# EAGLE design TES1 (EAGLE 9.6.2)
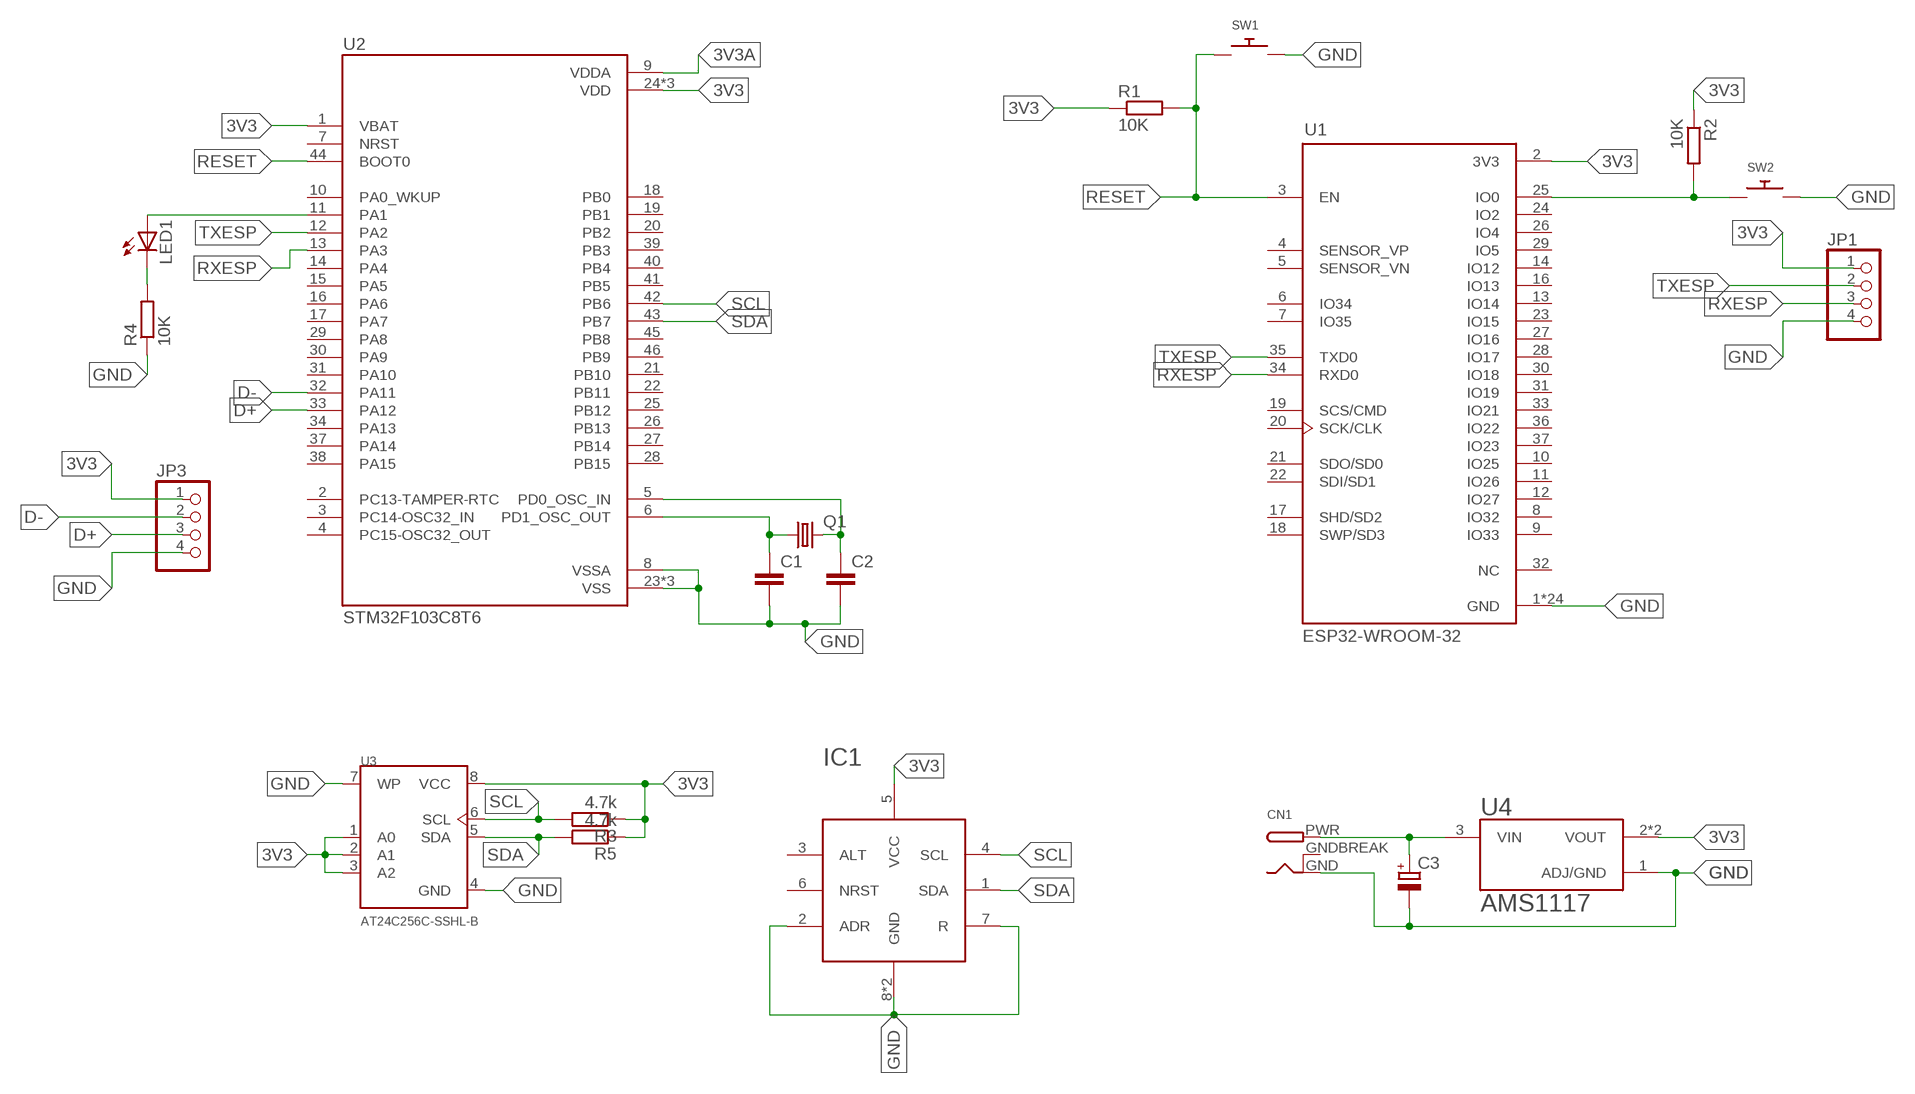
[diagram p0: schematic, sheet 1]

## Parts
C1  C-EUC0805  [C0805]
C2  C-EUC0805  [C0805]
C3  CPOL-EU150CLZ-0810  [150CLZ-0810]
CN1  DCBARRELPTH  [DCJACK_2MM_PTH]
IC1  SHT31  [SON50P250X250X90-9T110X180N]
JP1  PINHD-1X4  [1X04]
JP3  PINHD-1X4  [1X04]
LED1  LEDCHIP-LED0805  [CHIP-LED0805]
Q1  CRYSTALHC49U-V  [HC49U-V]
R1  10K  R-EU_R0805  [R0805]
R2  10K  R-EU_R0805  [R0805]
R3  4.7k  R-EU_R0805  [R0805]
R4  10K  R-EU_R0805  [R0805]
R5  4.7k  R-EU_R0805  [R0805]
SW1  SWITCH_PUSHBUTTONC&K_KSS  [BTN_CK_KSS]
SW2  SWITCH_PUSHBUTTONC&K_KSS  [BTN_CK_KSS]
U1  ESP32-WROOM-32  [MODULE_ESP32-WROOM-32]
U2  STM32F103C8T6  [QFP50P900X900X160-48N]
U3  AT24C256C-SSHL-B  [SOIC127P600X175-8N]
U4  AMS1117  [SOT229P700X180-4N]

## Nets
3V3: IC1.5(VCC) JP1.1 JP3.1 R1.1 R2.1 R3.1 R5.1 U1.2(3V3) U2.1(VBAT) U2.24(VDD) U2.36(VDD) U2.48(VDD) U3.1(A0) U3.2(A1) U3.3(A2) U3.8(VCC) U4.2(VOUT) U4.4(VOUT)
3V3A: U2.9(VDDA)
12V: C3.+ CN1.PWR U4.3(VIN)
D+: JP3.3 U2.33(PA12)
D-: JP3.2 U2.32(PA11)
GND: C1.2 C2.2 C3.- CN1.GND IC1.2(ADR) IC1.7(R) IC1.8(GND) IC1.9(GND) JP1.4 JP3.4 R4.1 SW1.P$2 SW2.P$2 U1.1(GND) U1.15(GND) U1.38(GND) U1.39_1(GND) U1.39_2(GND) U1.39_3(GND) U1.39_4(GND) U1.39_5(GND) U1.39_6(GND) U1.39_7(GND) U1.39_8(GND) U1.39_9(GND) U1.39_10(GND) U1.39_11(GND) U1.39_12(GND) U1.39_13(GND) U1.39_14(GND) U1.39_15(GND) U1.39_16(GND) U1.39_17(GND) U1.39_18(GND) U1.39_19(GND) U1.39_20(GND) U1.39_21(GND) U2.8(VSSA) U2.23(VSS) U2.35(VSS) U2.47(VSS) U3.4(GND) U3.7(WP) U4.1(ADJ/GND)
N$1: C1.1 Q1.1 U2.6(PD1_OSC_OUT)
N$2: C2.1 Q1.2 U2.5(PD0_OSC_IN)
N$4: R2.2 SW2.P$1 U1.25(IO0)
N$5: LED1.C R4.2
N$6: LED1.A U2.11(PA1)
RESET: R1.2 SW1.P$1 U1.3(EN) U2.44(BOOT0)
RXESP: JP1.3 U1.34(RXD0) U2.13(PA3)
SCL: IC1.4(SCL) R3.2 U2.42(PB6) U3.6(SCL)
SDA: IC1.1(SDA) R5.2 U2.43(PB7) U3.5(SDA)
TXESP: JP1.2 U1.35(TXD0) U2.12(PA2)
Unconnected: IC1.3(ALT) IC1.6(NRST) U1.4(SENSOR_VP) U1.5(SENSOR_VN) U1.6(IO34) U1.7(IO35) U1.8(IO32) U1.9(IO33) U1.10(IO25) U1.11(IO26) U1.12(IO27) U1.13(IO14) U1.14(IO12) U1.16(IO13) U1.17(SHD/SD2) U1.18(SWP/SD3) U1.19(SCS/CMD) U1.20(SCK/CLK) U1.21(SDO/SD0) U1.22(SDI/SD1) U1.23(IO15) U1.24(IO2) U1.26(IO4) U1.27(IO16) U1.28(IO17) U1.29(IO5) U1.30(IO18) U1.31(IO19) U1.32(NC) U1.33(IO21) U1.36(IO22) U1.37(IO23) U2.2(PC13-TAMPER-RTC) U2.3(PC14-OSC32_IN) U2.4(PC15-OSC32_OUT) U2.7(NRST) U2.10(PA0_WKUP) U2.14(PA4) U2.15(PA5) U2.16(PA6) U2.17(PA7) U2.18(PB0) U2.19(PB1) U2.20(PB2) U2.21(PB10) U2.22(PB11) U2.25(PB12) U2.26(PB13) U2.27(PB14) U2.28(PB15) U2.29(PA8) U2.30(PA9) U2.31(PA10) U2.34(PA13) U2.37(PA14) U2.38(PA15) U2.39(PB3) U2.40(PB4) U2.41(PB5) U2.45(PB8) U2.46(PB9)

## Power pins joined to a net without a drawn wire
GNDBREAK: CN1.GNDBREAK

## Library data of the parts
C1 C2 = rcl:C-EU: CAPACITOR, European symbol; SPICEPREFIX: C
C3 = rcl:CPOL-EU: POLARIZED CAPACITOR, European symbol; SPICEPREFIX: C
CN1 = adafruit:DCBARREL: 2.0mm DC Barrel Jack DCJACK_2MM_PTH - Through Hole Jack (4UConnector: 05537)
IC1 = SHT31:SHT31: A I2C temp/humidity sensor Check availability <https://pricing.snapeda.com/parts/SHT31/Sensirion%20AG/view-part?ref=eda>; AVAILABILITY: In Stock; CHECK_PRICES: https://www.snapeda.com/parts/SHT31/Sensirion+AG/view-part/?ref=eda; DESCRIPTION: Humidity Temperature Sensor 0 ~ 100% RH Analog Voltage ±2% RH 8s Surface Mount; MF: Sensirion AG; MP: SHT31; PACKAGE: VFDFN-8 Sensirion AG; PRICE: None; SNAPEDA_LINK: https://www.snapeda.com/parts/SHT31/Sensirion+AG/view-part/?ref=snap
JP1 JP3 = pinhead:PINHD-1X4: PIN HEADER
LED1 = adafruit:LED: LED OSRAM: - CHIPLED LG R971, LG N971, LY N971, LG Q971, LY Q971, LO R971, LY R971 LH N974, LH R974 LS Q976, LO Q976, LY Q976 LO Q996 - Hyper CHIPLED LW Q18S LB Q993, LB Q99A, LB R99A - SideLED LS A670, LO A670, LY A670, LG A670, LP A670 LB A673, LV A673, LT A673, LW A673 LH A674 LY A675 LS A676, LA A676, LO A676, LY A676, LW A676 LS A679, LY A679, LG A679 - Hyper Micro SIDELED® LS Y876, LA Y876, LO Y876, LY Y876 LT Y87S - SmartLED LW L88C, LW L88S LB L89C, LB L89S, LG L890 LS L89K, LO L89K, LY L89K LS L896, LA L896, LO L896, LY L896 - TOPLED LS T670, LO T670, LY T670, LG T670, LP T670 LSG T670, LSP T670, LSY T670, LOP T670, LYG T670 LG T671, LOG T671, LSG T671 LB T673, LV T673, LT T673, LW T673 LH T674 LS T676, LA T676, LO T676, LY T676, LB T676, LH T676, LSB T676, LW T676 LB T67C, LV T67C, LT T67C, LS T67K, LO T67K, LY T67K, LW E67C LS E67B, LA E67B, LO E67B, LY E67B, LB E67C, LV E67C, LT E67C LW T67C LS T679, LY T679, LG T679 LS T770, LO T770, LY T770, LG T770, LP T770 LB T773, LV T773, LT T773, LW T773 LH T774 LS E675, LA E675, LY E675, LS T675 LS T776, LA T776, LO T776, LY T776, LB T776 LHGB T686 LT T68C, LB T68C - Hyper Mini TOPLED® LB M676 - Mini TOPLED Santana® LG M470 LS M47K, LO M47K, LY M47K Source: http://www.osram.convergy.de/
Q1 = adafruit:CRYSTAL: CRYSTAL; OC_FARNELL: 1666969; OC_NEWARK: unknown
R1-R5 = rcl:R-EU_: RESISTOR, European symbol; SPICEPREFIX: R
SW1 SW2 = adafruit:SWITCH_PUSHBUTTON: Buttons SOFTTOUCHSMD_SJ - Soft touch temporary push button (Super Junk Akihabara) Compatible with SKPMANE010 [Mouser: 688-SKPMAN] C&K_KSS = Digikey: KSS221GLFS
U1 = ESP32-WROOM-32:ESP32-WROOM-32: Check availability <https://pricing.snapeda.com/parts/ESP32-WROOM-32/Espressif%20Systems/view-part?ref=eda>; AVAILABILITY: In Stock; CHECK_PRICES: https://www.snapeda.com/parts/ESP32-WROOM-32/Espressif+Systems/view-part/?ref=eda; DESCRIPTION: Bluetooth, WiFi 802.11b/g/n, Bluetooth v4.2 +EDR, Class 1, 2 and 3 Transceiver Module 2.4GHz ~ 2.5GHz Antenna Not Included, U.FL Surface Mount; MF: Espressif Systems; MP: ESP32-WROOM-32; PACKAGE: None; PRICE: None; SNAPEDA_LINK: https://www.snapeda.com/parts/ESP32-WROOM-32/Espressif+Systems/view-part/?ref=snap
U2 = STM32F103C8T6:STM32F103C8T6: Mainstream Performance line, ARM Cortex-M3 MCU with 64 Kbytes Flash, 72 MHz CPU, motor control, USB and CAN Check availability <https://pricing.snapeda.com/parts/STM32F103C8T6/STMicroelectronics/view-part?ref=eda>; AVAILABILITY: In Stock; CHECK_PRICES: https://www.snapeda.com/parts/STM32F103C8T6/STMicroelectronics/view-part/?ref=eda; DESCRIPTION: ARM® Cortex®-M3 STM32F1 Microcontroller IC 32-Bit 72MHz 64KB (64K x 8) FLASH 48-LQFP (7x7); MF: STMicroelectronics; MP: STM32F103C8T6; PACKAGE: LQFP-48 STMicroelectronics; PRICE: None; PURCHASE-URL: https://www.snapeda.com/api/url_track_click_mouser/?unipart_id=52195&manufacturer=STMicroelectronics&part_name=STM32F103C8T6&search_term=stm32f103c8t6; SNAPEDA_LINK: https://www.snapeda.com/parts/STM32F103C8T6/STMicroelectronics/view-part/?ref=snap
U3 = AT24C256C-SSHL-B:AT24C256C-SSHL-B: EEPROM Serial-2Wire 256K-bit 32K x 8 1.8V/2.5V/3.3V/5V 8-Pin SOIC Bulk Check availability <https://pricing.snapeda.com/parts/AT24C256C-SSHL-B/Microchip/view-part?ref=eda>; AVAILABILITY: In Stock; CHECK_PRICES: https://www.snapeda.com/parts/AT24C256C-SSHL-B/Microchip/view-part/?ref=eda; DESCRIPTION: EEPROM Memory IC 256Kb (32K x 8) I²C 1 MHz 550 ns 8-SOIC; MF: Microchip; MP: AT24C256C-SSHL-B; PACKAGE: SO-8 Microchip; PRICE: None; PURCHASE-URL: https://www.snapeda.com/api/url_track_click_mouser/?unipart_id=2112315&manufacturer=Microchip&part_name=AT24C256C-SSHL-B&search_term=at24c256; SNAPEDA_LINK: https://www.snapeda.com/parts/AT24C256C-SSHL-B/Microchip/view-part/?ref=snap
U4 = AMS1117:AMS1117: Sot223/Pkg 1-Amp 5-Volt Low Drop Out Voltage Regulatator Check availability <https://pricing.snapeda.com/parts/AMS1117/Advanced%20Monolithic%20Systems/view-part?ref=eda>; AVAILABILITY: Not in stock; CHECK_PRICES: https://www.snapeda.com/parts/AMS1117/Advanced+Monolithic+Systems/view-part/?ref=eda; DESCRIPTION: 1A LOW DROPOUT VOLTAGE REGULATOR SOT-223; MF: Advanced Monolithic Systems; MP: AMS1117; PACKAGE: SOT-223 Seeed Technology; PRICE: None; SNAPEDA_LINK: https://www.snapeda.com/parts/AMS1117/Advanced+Monolithic+Systems/view-part/?ref=snap

## Board
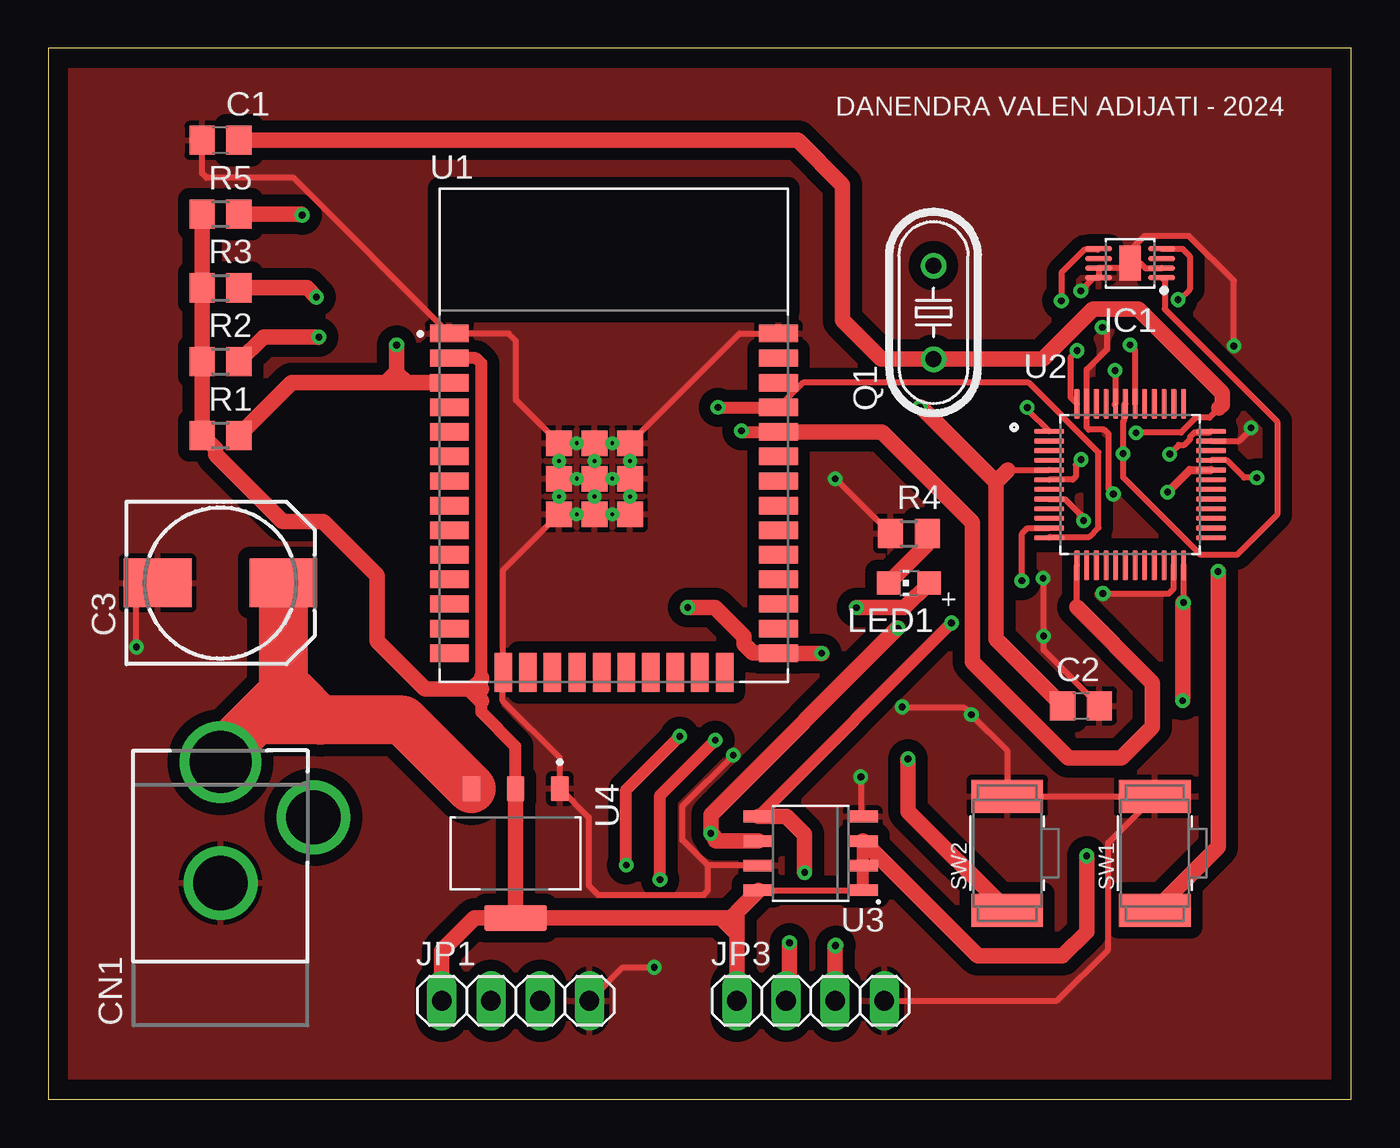
[diagram p1: board, top side]
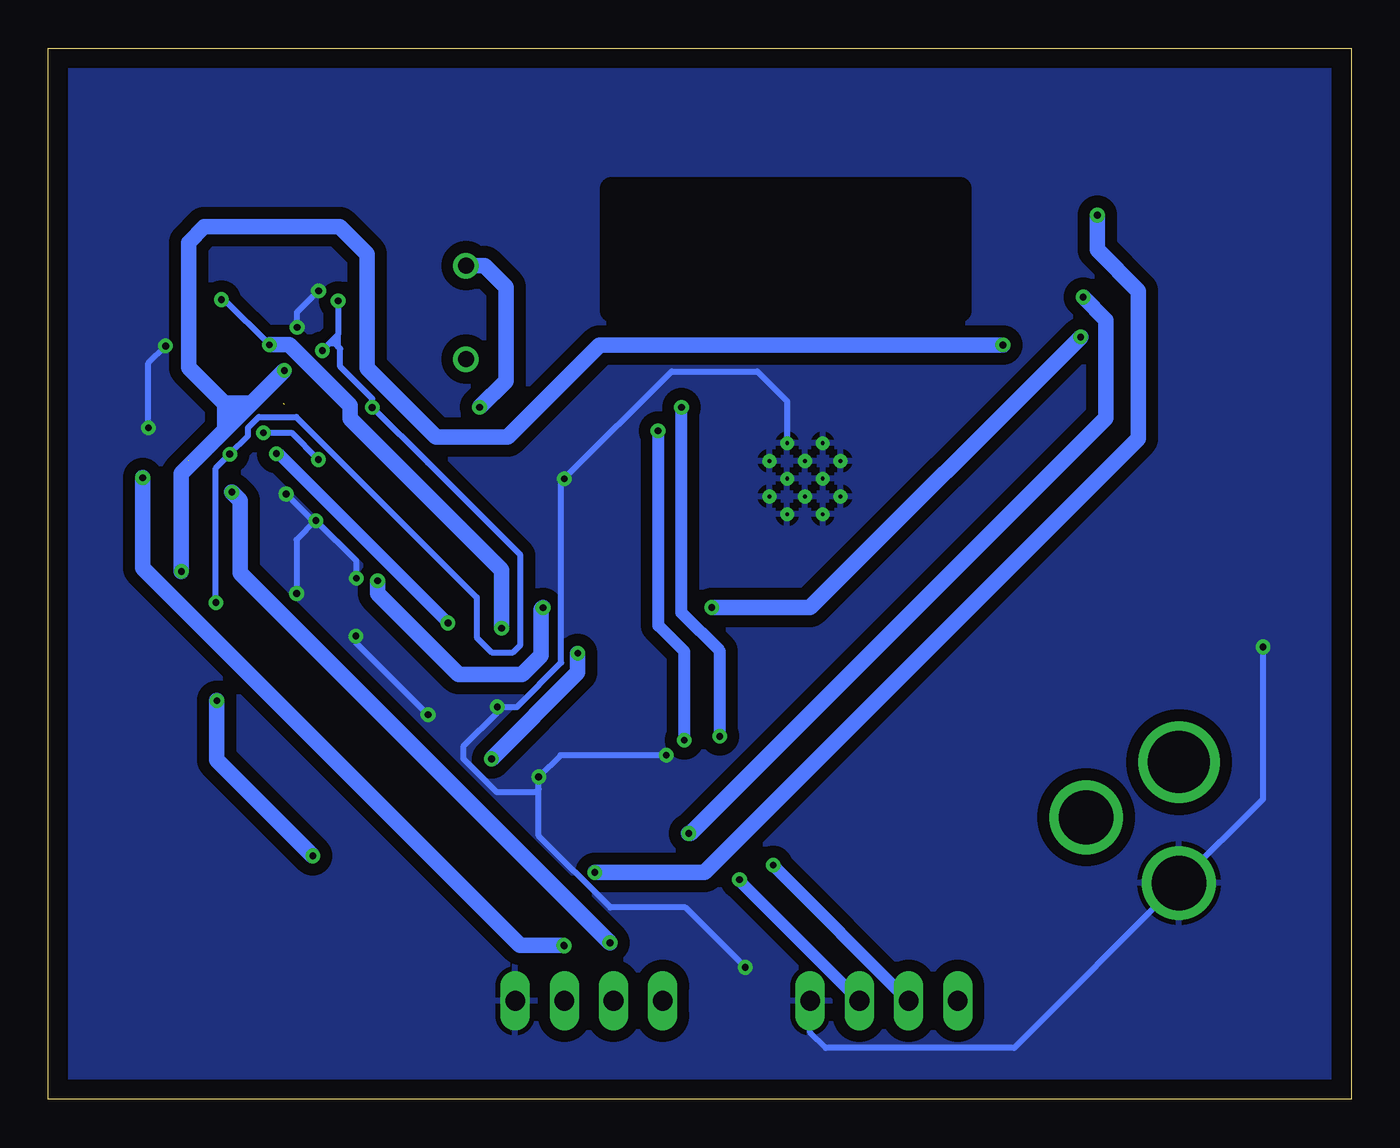
[diagram p2: board, bottom side, seen from below]

Size 67.29 x 54.28 mm. Coordinates in mm from the lower left corner, seen from the top.
Outline: 0,0 67.29,0 67.29,54.28 0,54.28 0,0
Copper layers (1*16): Top 0.035mm / dielectric 1.5mm / Bottom 0.035mm
Design rules "default": minimum track width 6mil, minimum drill 0.35mm, track to track 6mil, track to pad 6mil, pad to pad 6mil, via to via 6mil, smd to smd 6mil, copper to edge 40mil, drill to drill 6mil, minimum pad ring 10mil, minimum via ring 8mil, stop-mask expansion 4mil, vias tented up to drill 0mil, thermal gap 10mil

### Footprints (pad centres in the part's own frame; a part is rotated, then mirrored left to right if it is on the bottom)
C0805 = smd 1.3 x 1.5: 1 -0.95,0; 2 0.95,0
150CLZ-0810 = smd 3.5 x 2.5: + 3.25,0; - -3.25,0
DCJACK_2MM_PTH = drill 2.8: GND 0,7.35; GNDBREAK 4.8,10.75 | drill 3.2: PWR 0,13.6
SON50P250X250X90-9T110X180N = smd 1.4 x 0.282: 1 -1.625,0.75; 2 -1.625,0.25; 3 -1.625,-0.25; 4 -1.625,-0.75; 5 1.625,-0.75; 6 1.625,-0.25; 7 1.625,0.25; 8 1.625,0.75 | smd 1.1 x 1.8: 9 0,0
1X04 = drill 1.016 long: 1 -3.81,0; 2 -1.27,0; 3 1.27,0; 4 3.81,0
CHIP-LED0805 = smd 1.2 x 1.2: A 0,-1.05; C 0,1.05
HC49U-V = drill 0.813: 1 -2.413,0; 2 2.413,0
R0805 = smd 1.3 x 1.5: 1 -0.95,0; 2 0.95,0
BTN_CK_KSS = smd 1.7 x 3.7: P$1 -2.95,0; P$2 2.95,0
MODULE_ESP32-WROOM-32 = smd 2 x 0.9: 1 -8.5,5.26; 2 -8.5,3.99; 3 -8.5,2.72; 4 -8.5,1.45; 5 -8.5,0.18; 6 -8.5,-1.09; 7 -8.5,-2.36; 8 -8.5,-3.63; 9 -8.5,-4.9; 10 -8.5,-6.17; 11 -8.5,-7.44; 12 -8.5,-8.71; 13 -8.5,-9.98; 14 -8.5,-11.25; 25 8.5,-11.25; 26 8.5,-9.98; 27 8.5,-8.71; 28 8.5,-7.44; 29 8.5,-6.17; 30 8.5,-4.9; 31 8.5,-3.63; 32 8.5,-2.36; 33 8.5,-1.09; 34 8.5,0.18; 35 8.5,1.45; 36 8.5,2.72; 37 8.5,3.99; 38 8.5,5.26 | smd 0.9 x 2: 15 -5.715,-12.25; 16 -4.445,-12.25; 17 -3.175,-12.25; 18 -1.905,-12.25; 19 -0.635,-12.25; 20 0.635,-12.25; 21 1.905,-12.25; 22 3.175,-12.25; 23 4.445,-12.25; 24 5.715,-12.25 | smd 1.33 x 1.33: 39_1 -2.835,-0.405; 39_2 -1,-0.405; 39_3 0.835,-0.405; 39_4 -2.835,-2.24; 39_5 -1,-2.24; 39_6 0.835,-2.24; 39_7 -2.835,-4.075; 39_8 -1,-4.075; 39_9 0.835,-4.075 | drill 0.2 pad 0.3: 39_10 -1.917,-0.405; 39_11 -0.083,-0.405; 39_12 -2.835,-1.323; 39_13 -1,-1.323; 39_14 0.835,-1.323; 39_15 -1.917,-2.24; 39_16 -0.083,-2.24; 39_17 -2.835,-3.158; 39_18 -1,-3.158; 39_19 0.835,-3.158; 39_20 -1.917,-4.075; 39_21 -0.083,-4.075
QFP50P900X900X160-48N = smd 1.56 x 0.28: 1 -4.18,2.75; 2 -4.18,2.25; 3 -4.18,1.75; 4 -4.18,1.25; 5 -4.18,0.75; 6 -4.18,0.25; 7 -4.18,-0.25; 8 -4.18,-0.75; 9 -4.18,-1.25; 10 -4.18,-1.75; 11 -4.18,-2.25; 12 -4.18,-2.75; 25 4.18,-2.75; 26 4.18,-2.25; 27 4.18,-1.75; 28 4.18,-1.25; 29 4.18,-0.75; 30 4.18,-0.25; 31 4.18,0.25; 32 4.18,0.75; 33 4.18,1.25; 34 4.18,1.75; 35 4.18,2.25; 36 4.18,2.75 | smd 0.28 x 1.56: 13 -2.75,-4.18; 14 -2.25,-4.18; 15 -1.75,-4.18; 16 -1.25,-4.18; 17 -0.75,-4.18; 18 -0.25,-4.18; 19 0.25,-4.18; 20 0.75,-4.18; 21 1.25,-4.18; 22 1.75,-4.18; 23 2.25,-4.18; 24 2.75,-4.18; 37 2.75,4.18; 38 2.25,4.18; 39 1.75,4.18; 40 1.25,4.18; 41 0.75,4.18; 42 0.25,4.18; 43 -0.25,4.18; 44 -0.75,4.18; 45 -1.25,4.18; 46 -1.75,4.18; 47 -2.25,4.18; 48 -2.75,4.18
SOIC127P600X175-8N = smd 1.55 x 0.6: 1 -2.7,1.905; 2 -2.7,0.635; 3 -2.7,-0.635; 4 -2.7,-1.905; 5 2.7,-1.905; 6 2.7,-0.635; 7 2.7,0.635; 8 2.7,1.905
SOT229P700X180-4N = smd 1.31 x 0.93: 1 -3.345,2.29; 2 -3.345,0; 3 -3.345,-2.29 | smd 1.31 x 3.24: 4 3.345,0

### Placement (x,y rotation side)
C1  8.89,49.53 180 top
C2  53.34,20.32 0 top
C3  8.89,26.67 0 top
CN1  8.89,3.81 0 top
IC1  55.88,43.18 180 top
JP1  24.13,5.08 0 top
JP3  39.37,5.08 0 top
LED1  44.45,26.67 90 top
Q1  45.72,40.64 90 top
R1  8.89,34.29 0 top
R2  8.89,38.1 0 top
R3  8.89,41.91 0 top
R4  44.45,29.21 0 top
R5  8.89,45.72 0 top
SW1  57.15,12.7 90 top
SW2  49.53,12.7 90 top
U1  29.21,34.29 0 top
U2  55.88,31.75 0 top
U3  39.37,12.7 180 top
U4  24.13,12.7 270 top

### Tracks (layer width: path | path; a pad name or v marks a point on that pad's centre or on a via)
3V3  (via drill 0.35)
  Top 0.305: IC1.5 54.2,43.88 53.51,43.88 52.33,42.69 v52.33,41.23 | v53.14,38.67 52.79,38.32 52.79,36.27 U2.48 | U2.24 58.63,25.66 v58.64,25.65 | v57.92,33.32 58.39,33.79 58.67,33.79 58.98,34.1 58.98,34.23 59.2,34.45 60.01,34.45 U2.36 | U2.1 50.59,35.61 50.59,35.78 50.56,35.76 v50.56,35.73 | U3.8 U3.1
  Top 0.61: U4.2 24.13,18.23 22.36,19.99 22.36,20.58 22.36,21.18 22.36,21.77 22.36,38 22.09,38.28 U1.2 | U3.1 U3.2 U3.3
  Top 0.813: R5.1 R3.1 R2.1 R1.1 8.63,33.6 8.63,33.31 12.1,29.84 14.19,29.84 16.97,27.06 16.97,23.67 19.47,21.18 21.85,21.18 | U4.4 22.02,9.36 20.32,7.65 JP1.1 | JP3.1 35.56,8.55 | 35.56,8.55 35.56,9.69 | U3.8 35.56,9.69 | 35.56,9.69 35.23,9.36 34.75,9.36 | 34.75,9.36 U4.4 | 35.56,8.55 34.75,9.36 | U4.4 U4.2 | U3.3 48.01,7.4 52.38,7.4 53.63,8.64 v53.63,12.57 | v58.59,20.59 58.59,25.62 58.63,25.66 | 21.85,21.18 22.36,21.18 | 21.85,21.18 22.36,21.69 22.36,21.77 | 21.85,21.18 21.85,21.09 22.36,20.58
  Bottom 0.305: v52.33,41.23 52.33,39.48 | 52.33,39.48 52.71,39.1 | 52.71,39.1 52.78,39.03 | 52.78,39.03 v53.14,38.67 | v58.64,25.65 58.64,32.6 v57.92,33.32 56.98,34.26 56.98,34.68 56.42,35.24 54.48,35.24 45.17,25.92 45.17,23.85 44.39,23.08 43.3,23.08 42.91,23.47 42.91,28.11 47.67,32.87 47.68,32.87 50.54,35.73 v50.56,35.73 50.56,36.19 52.22,37.84 52.22,38.76 52.33,38.87 | 52.33,38.87 52.33,39.48 | 52.33,38.87 52.49,39.03 | 52.49,39.03 52.55,39.1 52.71,39.1 | 52.49,39.03 52.78,39.03
  Bottom 0.813: v53.63,12.57 58.59,17.52 v58.59,20.59
12V
  Top 2.54: CN1.PWR 8.89,17.78 10.7,19.59 | 12.14,21.03 C3.+ | 10.7,19.59 12.14,21.03 | U4.3 18.3,19.59 14.05,19.59 | 14.05,19.59 10.7,19.59 | 14.05,19.59 12.6,21.03 12.14,21.03
D+  (via drill 0.35)  (1 unrouted)
  Top 0.305: v62.42,32.1 61.77,32.1 60.86,33.01 U2.33
  Top 0.813: JP3.3 v40.64,7.92 v40.67,7.95
  Bottom 0.813: v40.67,7.95 42.93,7.95 62.42,27.43 v62.42,32.1
D-  (via drill 0.35)
  Top 0.406: v57.81,31.36 58.95,32.5 U2.32
  Top 0.813: JP3.2 38.28,5.26 v38.28,8.08
  Bottom 0.813: v38.28,8.08 57.38,27.18 57.38,30.92 v57.81,31.36
GND  (via drill 0.35)
  Top 0.305: v4.55,23.36 4.55,25.58 C3.- | U1.39_7 23.5,27.34 U1.15 23.47,22.02 23.47,20.57 26.42,17.62 U4.1 27.9,14.56 27.9,11.04 28.4,10.54 33.84,10.54 34.07,10.78 34.07,12.06 | 28.21,30.37 U1.39_8 28.23,30.23 30.05,30.23 | 28.21,30.37 U1.39_5 28.21,32.07 | U1.39_7 26.53,30.37 28.21,30.37 | U1.39_3 35.71,39.55 U1.38 | U1.39_1 24.15,36.11 24.15,39.17 23.78,39.55 U1.1 12.66,47.6 8.17,47.6 7.94,47.83 C1.2 | R4.1 40.66,32.05 v40.64,32.05 | U1.39_3 U1.39_6 | U1.39_6 30.05,30.23 | 30.05,30.23 U1.39_9 | U1.39_7 U1.39_4 U1.39_1 | U1.39_2 28.21,32.07 | U1.39_1 U1.39_2 | U1.39_2 U1.39_3 | U1.39_6 28.23,32.05 28.21,32.07 | C2.2 51.41,23.2 v51.41,23.92 51.41,26.93 51.41,26.94 v51.38,26.91 | v53.48,29.88 53.48,30.03 52.51,31 U2.8 | v44.1,20.26 44.1,20.2 47.34,20.2 v47.68,19.86 49.53,18.01 SW2.P$2 SW1.P$2 54.75,13.25 54.75,7.72 52.1,5.08 JP3.4 | v41.97,16.64 41.97,14.71 U3.4 | U3.7 34.07,12.06 | 34.07,12.06 32.75,13.39 32.75,15.14 v35.38,17.77 | JP1.4 29.67,6.81 v31.29,6.81 | IC1.9 55.63,42.93 IC1.7 IC1.8 54.01,42.43 v53.34,41.76 | IC1.9 56.4,43.18 56.66,42.92 57.49,42.92 IC1.2 | U2.35 61.52,34 62.12,34.61 v62.12,34.68 | v61.24,38.91 61.24,42.27 58.92,44.59 56.61,44.59 55.87,43.84 55.87,43.19 IC1.9 | v54.46,26.12 57.87,26.12 58.13,26.38 U2.23 | v54.44,39.87 54.62,39.87 54.69,39.8 54.69,38.75 53.63,37.69 U2.47 53.63,34.7 53.74,34.58 54.54,34.58 54.77,34.36 54.77,31.5 v55.01,31.26
  Bottom 0.305: JP1.4 27.94,3.46 27.13,2.65 17.4,2.65 CN1.GND 4.55,15.5 v4.55,23.36 | U1.39_11 29.13,36.05 30.67,37.59 35.1,37.59 v40.64,32.05 40.8,31.89 40.8,22.55 43.09,20.26 v44.1,20.26 44.1,19.98 45.86,18.21 45.86,17.59 44.13,15.86 42.11,15.86 41.97,16 | v51.41,23.92 51.41,23.59 v47.68,19.86 | v51.38,26.91 51.38,27.79 v53.48,29.88 | 41.97,16 v41.97,16.64 40.84,17.77 v35.38,17.77 | v31.29,6.81 34.38,9.9 38.26,9.9 41.97,13.6 41.97,16 | v62.12,34.68 62.12,38.02 v61.24,38.91 | v53.48,29.88 54.47,28.89 v54.47,26.12 v54.46,26.12 | v54.44,39.87 54.44,40.65 v53.34,41.76 | v53.48,29.88 53.63,29.88 v55.01,31.26
  pour Top (isolate 0.61): 0,54.61 0,0 67.31,0 67.31,54.61
  pour Bottom (isolate 0.61): 0,54.61 0,0 67.31,0 67.31,54.61
N$1  (via drill 0.35)
  Top 0.305: 60.46,35.69 59.97,35.2 59.28,35.2 58.5,34.42 v56.19,34.42 | v53.35,33.04 53.07,32.76 53.07,32.16 52.91,32 U2.6
  Top 0.813: C1.1 38.71,49.53 41.01,47.22 41.01,40.24 43.03,38.23 Q1.1 51.37,38.23 53.95,40.81 56.31,40.81 60.63,36.48 60.63,35.87 60.46,35.69
  Bottom 0.305: v56.19,34.42 54.73,34.42 v53.35,33.04
N$2  (via drill 0.35)
  Top 0.305: 49.56,32.5 U2.5
  Top 0.813: C2.1 48.93,23.78 48.93,31.87 | 49.56,32.5 48.93,31.87 | 48.93,31.87 45.06,35.74 v45.02,35.74
  Bottom 0.813: v45.02,35.74 43.66,37.1 43.66,41.95 44.77,43.05 Q1.2
N$4  (via drill 0.35)
  Top 0.813: R2.2 11.11,39.37 v13.97,39.37 | v33.02,25.4 34.43,25.4 35.92,23.9 35.92,23.51 36.4,23.04 U1.25 v39.95,23.03 | SW2.P$1 44.4,14.88 v44.4,17.57
  Bottom 0.813: v13.97,39.37 27.94,25.4 v33.02,25.4 | v44.4,17.57 39.95,22.03 v39.95,23.03
N$5
  Top 0.813: R4.2 45.4,28.67 LED1.C
N$6  (via drill 0.35)
  Top 0.305: v50.29,26.78 50.29,29.21 50.58,29.5 U2.11
  Top 0.813: LED1.A 44.22,25.39 v41.74,25.39
  Bottom 0.813: v41.74,25.39 41.84,25.29 41.84,22.93 42.83,21.94 46.1,21.94 50.29,26.12 v50.29,26.78
RESET  (via drill 0.35)  (1 unrouted)
  Top 0.305: v55.1,37.64 55.1,35.95 55.12,35.94 55.12,35.93 55.08,35.89 55.08,35.87
  Top 0.813: R1.2 12.56,37.01 17.44,37.01 | 17.44,37.01 18.01,37.01 | U1.3 18.52,37.01 | 18.52,37.01 18.01,37.01 | SW1.P$1 60.42,13.02 v60.42,27.26 | 18.01,37.01 17.99,37.03 17.99,37.54 | 17.99,37.54 v17.99,38.96 | 18.52,37.01 17.99,37.54 | 17.44,37.01 17.97,37.54 17.99,37.54
  Bottom 0.813: v60.42,27.26 60.42,32.33 58.18,34.56 | 58.18,34.56 57.5,35.24 | 57.5,35.24 56.79,35.96 | 56.79,35.96 v55.1,37.64 | v17.99,38.96 38.83,38.96 43.57,34.21 47.28,34.21 50.84,37.77 50.84,43.65 52.25,45.06 59.23,45.06 60.05,44.25 60.05,37.79 58.12,35.86 | 58.12,35.86 57.5,35.24 | 58.18,34.56 58.18,35.79 58.12,35.86 | 56.79,35.96 58.02,35.96 58.12,35.86
RXESP  (via drill 0.35)
  Top 0.305: 53.11,25.42 53.11,27.55 U2.13
  Top 0.61: v31.59,11.34 31.59,15.69 v34.44,18.54 | v35.8,34.52 35.85,34.47 U1.34
  Top 0.813: U1.34 43.05,34.47 47.72,29.8 47.72,22.6 52.69,17.62 55.41,17.62 57.02,19.23 57.02,21.51 53.11,25.42
  Bottom 0.61: JP1.3 31.59,11.28 v31.59,11.34 | v34.44,18.54 34.44,23.12 35.78,24.46 35.78,34.52 v35.8,34.52
SCL  (via drill 0.35)
  Top 0.305: v55.87,38.97 56.13,38.71 U2.42 | IC1.4 58.58,43.93 58.95,43.56 58.95,41.83 58.43,41.3 v58.35,41.3
  Top 0.813: R3.2 13.36,41.91 v13.84,41.43 | U3.6 34.49,13.34 34.43,13.39 34.43,13.51 v34.22,13.73 34.22,14.69 43.86,24.33 v43.88,24.33
  Bottom 0.305: v58.35,41.3 58.21,41.3 v55.87,38.97
  Bottom 0.813: v13.84,41.43 12.66,40.25 12.66,35.18 34.11,13.73 v34.22,13.73 | v55.87,38.97 54.86,38.97 51.72,35.82 51.72,35.16 43.88,27.33 v43.88,24.33
SDA  (via drill 0.35)
  Top 0.305: U2.43 55.58,35.88 55.58,35.06 55.52,35.01 v55.52,33.34 55.52,32.12 59.52,28.12 61.39,28.12 63.47,30.19 63.47,35 57.66,40.82 57.66,42.27 IC1.1
  Top 0.61: U3.5 46.65,24.59 v46.65,24.6
  Top 0.813: R5.2 13.05,45.72 v13.11,45.66 | v39.07,11.71 39.07,13.67 38.13,14.61 U3.5
  Bottom 0.61: v46.65,24.6 55.4,33.34 v55.52,33.34
  Bottom 0.813: v13.11,45.66 13.11,43.88 10.98,41.75 10.98,34.13 33.4,11.71 v39.07,11.71
TXESP  (via drill 0.35)
  Top 0.305: U2.12 51.74,29.04 53.76,29.04 54.24,29.52 54.24,33.41 50.63,37.01 38.98,37.01 U1.35
  Top 0.61: v29.85,12.09 29.85,15.98 v32.61,18.74 | v34.59,35.73 U1.35
  Bottom 0.61: JP1.2 29.85,12.07 v29.85,12.09 | v32.61,18.74 32.61,23.14 34.59,25.12 v34.59,35.73

### Text on the board
tNames: DANENDRA VALEN ADIJATI - 2024